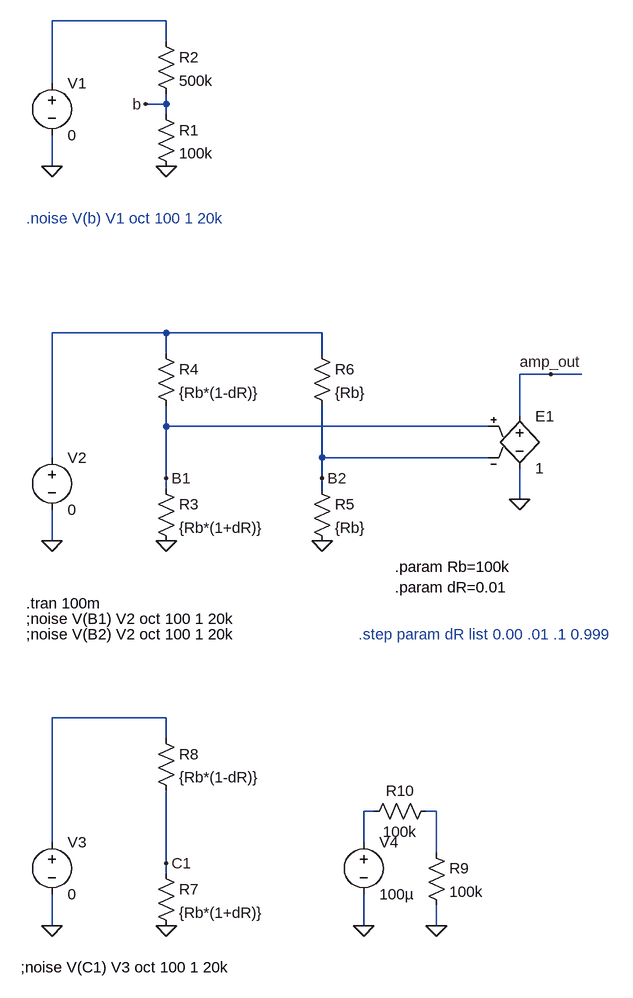
[diagram p0: schematic noise_tests.asc]
noise_tests.asc, the LTspice schematic file:
Version 4
SHEET 1 1088 1552
WIRE 336 80 160 80
WIRE 336 112 336 80
WIRE 160 176 160 80
WIRE 336 208 336 192
WIRE 336 208 304 208
WIRE 336 224 336 208
WIRE 160 304 160 256
WIRE 336 560 160 560
WIRE 576 560 336 560
WIRE 336 592 336 560
WIRE 576 592 576 560
WIRE 928 624 880 624
WIRE 976 624 928 624
WIRE 880 688 880 624
WIRE 336 704 336 672
WIRE 832 704 336 704
WIRE 160 752 160 560
WIRE 576 752 576 672
WIRE 832 752 576 752
WIRE 336 784 336 704
WIRE 576 784 576 752
WIRE 336 800 336 784
WIRE 576 800 576 784
WIRE 880 816 880 768
WIRE 160 880 160 832
WIRE 336 1152 160 1152
WIRE 336 1184 336 1152
WIRE 656 1296 640 1296
WIRE 752 1296 736 1296
WIRE 160 1344 160 1152
WIRE 640 1344 640 1296
WIRE 752 1360 752 1296
WIRE 336 1376 336 1264
WIRE 336 1392 336 1376
WIRE 160 1472 160 1424
WIRE 640 1472 640 1424
WIRE 752 1472 752 1440
FLAG 160 304 0
FLAG 336 304 0
FLAG 304 208 b
FLAG 160 880 0
FLAG 336 880 0
FLAG 576 880 0
FLAG 336 784 B1
FLAG 576 784 B2
FLAG 880 816 0
FLAG 928 624 amp_out
FLAG 160 1472 0
FLAG 336 1472 0
FLAG 336 1376 C1
FLAG 640 1472 0
FLAG 752 1472 0
SYMBOL res 320 208 R0
SYMATTR InstName R1
SYMATTR Value 100k
SYMBOL voltage 160 160 R0
WINDOW 123 0 0 Left 2
WINDOW 39 0 0 Left 2
SYMATTR InstName V1
SYMATTR Value 0
SYMBOL res 320 96 R0
SYMATTR InstName R2
SYMATTR Value 500k
SYMBOL res 320 784 R0
SYMATTR InstName R3
SYMATTR Value {Rb*(1+dR)}
SYMBOL voltage 160 736 R0
WINDOW 123 0 0 Left 2
WINDOW 39 0 0 Left 2
SYMATTR InstName V2
SYMATTR Value 0
SYMBOL res 320 576 R0
SYMATTR InstName R4
SYMATTR Value {Rb*(1-dR)}
SYMBOL res 560 784 R0
SYMATTR InstName R5
SYMATTR Value {Rb}
SYMBOL res 560 576 R0
SYMATTR InstName R6
SYMATTR Value {Rb}
SYMBOL e 880 672 R0
SYMATTR InstName E1
SYMATTR Value 1
SYMBOL res 320 1376 R0
SYMATTR InstName R7
SYMATTR Value {Rb*(1+dR)}
SYMBOL voltage 160 1328 R0
WINDOW 123 0 0 Left 2
WINDOW 39 0 0 Left 2
SYMATTR InstName V3
SYMATTR Value 0
SYMBOL res 320 1168 R0
SYMATTR InstName R8
SYMATTR Value {Rb*(1-dR)}
SYMBOL voltage 640 1328 R0
WINDOW 123 0 0 Left 2
WINDOW 39 0 0 Left 2
SYMATTR InstName V4
SYMATTR Value 100µ
SYMBOL res 736 1344 R0
SYMATTR InstName R9
SYMATTR Value 100k
SYMBOL res 752 1280 R90
WINDOW 0 0 56 VBottom 2
WINDOW 3 32 56 VTop 2
SYMATTR InstName R10
SYMATTR Value 100k
TEXT 120 384 Left 2 ;.noise V(b) V1 oct 100 1 20k
TEXT 120 976 Left 2 !.tran 100m
TEXT 688 920 Left 2 !.param Rb=100k\n.param dR=0.01
TEXT 120 1000 Left 2 !;noise V(B1) V2 oct 100 1 20k
TEXT 120 1024 Left 2 !;noise V(B2) V2 oct 100 1 20k
TEXT 632 1024 Left 2 ;.step param dR list 0.00 .01 .1 0.999
TEXT 112 1536 Left 2 !;noise V(C1) V3 oct 100 1 20k

The netlist it stands for:
* noise_tests.asc
R1 b 0 100k
V1 N001 0 0
R2 N001 b 500k
R3 B1 0 {Rb*(1+dR)}
V2 N002 0 0
R4 N002 B1 {Rb*(1-dR)}
R5 B2 0 {Rb}
R6 N002 B2 {Rb}
E1 amp_out 0 B1 B2 1
R7 C1 0 {Rb*(1+dR)}
V3 N003 0 0
R8 N003 C1 {Rb*(1-dR)}
V4 N004 0 100µ
R9 N005 0 100k
R10 N005 N004 100k
* .noise V(b) V1 oct 100 1 20k
.tran 100m
.param Rb=100k
.param dR=0.01
;noise V(B1) V2 oct 100 1 20k
;noise V(B2) V2 oct 100 1 20k
* .step param dR list 0.00 .01 .1 0.999
;noise V(C1) V3 oct 100 1 20k
.backanno
.end